# Altium schematic sheet REVERSION.SchDoc: REVERSION
size A3; Author: nq_minh_; SheetNumber: 1; SheetTotal: 5; ProjectTitle: ESPC3-RF
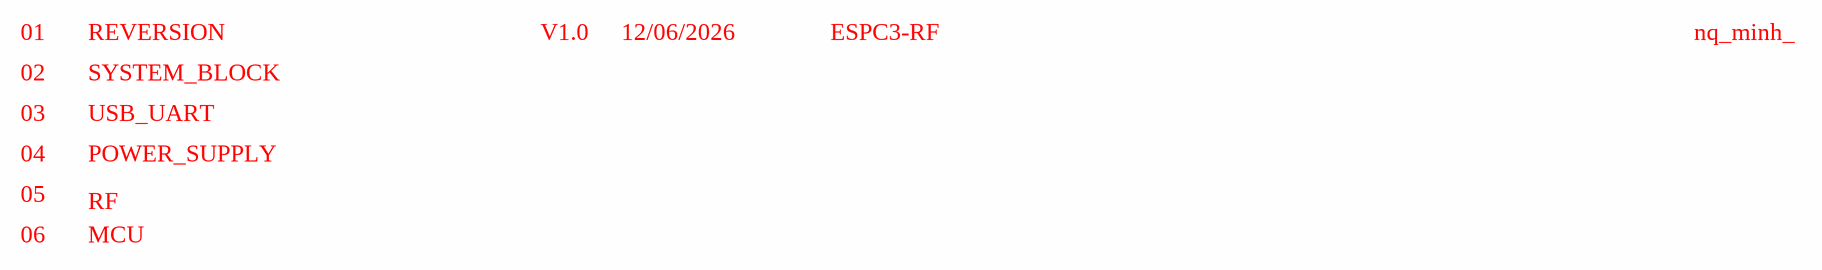
[diagram p0: REVERSION.SchDoc]

## Notes on the sheet
- 01
- REVERSION
- V1.0
- 12/06/2026
- ESPC3-RF
- nq_minh_
- 02
- 03
- SYSTEM_BLOCK
- USB_UART
- 04
- POWER_SUPPLY
- 05
- 06
- RF
- MCU
- TABLES OF CONTENTS
- PAGE
- CONTENT
- VER#
- DATE
- REVISION HISTORY
- DESCIPTION OF CHANGES
- AUTHOR
- Author:
- Title:
- Size:
- A3
- Project:
- Revision:
- Modified Date:
- CheckedBy:
- Date:
- SW Version: